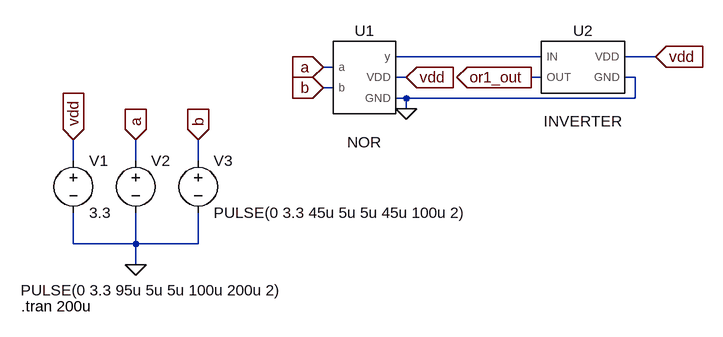
[diagram p0: schematic or1_raw.asc]
or1_raw.asc, the LTspice schematic file:
Version 4.1
SHEET 1 880 680
WIRE 384 96 160 96
WIRE 560 96 512 96
WIRE 64 112 48 112
WIRE 176 128 160 128
WIRE 384 128 368 128
WIRE 528 128 512 128
WIRE 64 144 48 144
WIRE 176 160 160 160
WIRE 528 160 528 128
WIRE 528 160 176 160
WIRE 176 176 176 160
WIRE -336 256 -336 224
WIRE -240 256 -240 224
WIRE -144 256 -144 224
WIRE -336 384 -336 336
WIRE -240 384 -240 336
WIRE -240 384 -336 384
WIRE -144 384 -144 336
WIRE -144 384 -240 384
WIRE -240 416 -240 384
FLAG 176 176 0
FLAG 176 128 vdd
IOPIN 176 128 In
FLAG 560 96 vdd
IOPIN 560 96 In
FLAG 48 112 a
IOPIN 48 112 In
FLAG 48 144 b
IOPIN 48 144 In
FLAG 368 128 or1_out
IOPIN 368 128 Out
FLAG -240 416 0
FLAG -336 224 vdd
IOPIN -336 224 In
FLAG -240 224 a
IOPIN -240 224 In
FLAG -144 224 b
IOPIN -144 224 In
SYMBOL nor 112 128 R0
WINDOW 3 0 56 Invisible 2
WINDOW 38 0 84 Top 2
SYMATTR InstName U1
SYMATTR Value ""
SYMATTR SpiceModel NOR
SYMBOL inverter 448 112 R0
WINDOW 3 0 40 Invisible 2
WINDOW 38 0 68 Top 2
SYMATTR InstName U2
SYMATTR Value ""
SYMBOL voltage -336 240 R0
WINDOW 123 0 0 Left 0
WINDOW 39 0 0 Left 0
SYMATTR InstName V1
SYMATTR Value 3.3
SYMBOL voltage -240 240 R0
WINDOW 3 -177 215 Left 2
WINDOW 123 0 0 Left 0
WINDOW 39 0 0 Left 0
SYMATTR Value PULSE(0 3.3 95u 5u 5u 100u 200u 2)
SYMATTR InstName V2
SYMBOL voltage -144 240 R0
WINDOW 123 0 0 Left 0
WINDOW 39 0 0 Left 0
SYMATTR InstName V3
SYMATTR Value PULSE(0 3.3 45u 5u 5u 45u 100u 2)
TEXT -416 480 Left 2 !.tran 200u

The netlist it stands for:
* or1_raw.asc
X§U1 a b N001 vdd 0 NOR  ; pins a b y VDD GND
X§U2 N001 or1_out vdd 0 INVERTER  ; pins IN OUT VDD GND
V1 vdd 0 3.3
V2 a 0 PULSE(0 3.3 95u 5u 5u 100u 200u 2)
V3 b 0 PULSE(0 3.3 45u 5u 5u 45u 100u 2)
.tran 200u
.lib yap_cells.lib
.backanno
.end